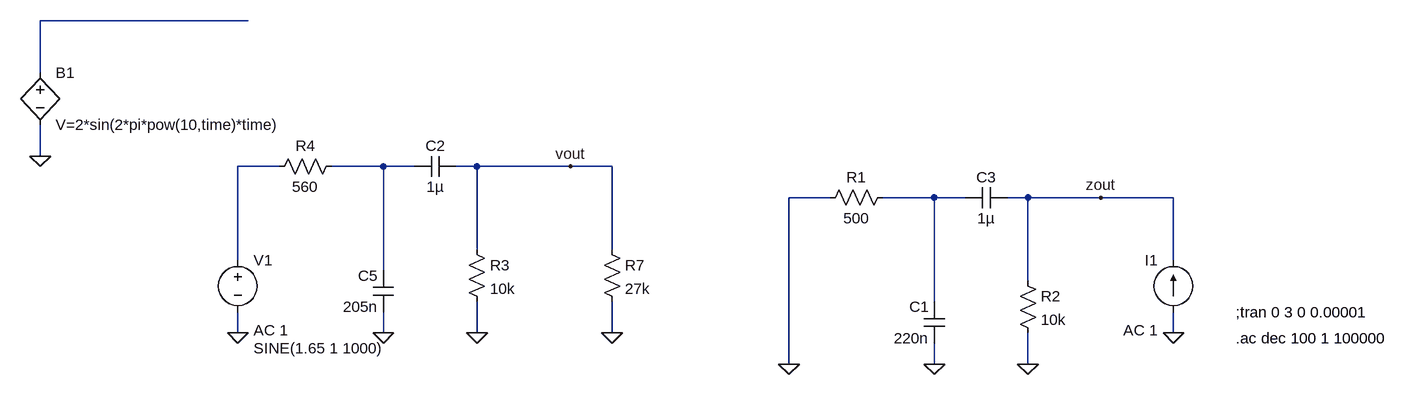
[diagram p0: schematic antialising_output.asc]
antialising_output.asc, the LTspice schematic file:
Version 4
SHEET 1 1128 680
WIRE -672 -64 -992 -64
WIRE -992 16 -992 -64
WIRE -992 144 -992 96
WIRE -624 160 -688 160
WIRE -464 160 -544 160
WIRE -416 160 -464 160
WIRE -320 160 -352 160
WIRE -176 160 -320 160
WIRE -112 160 -176 160
WIRE 224 208 160 208
WIRE 384 208 304 208
WIRE 432 208 384 208
WIRE 528 208 496 208
WIRE 640 208 528 208
WIRE 752 208 640 208
WIRE -320 288 -320 160
WIRE -112 288 -112 160
WIRE -688 304 -688 160
WIRE 752 304 752 208
WIRE -464 320 -464 160
WIRE 528 336 528 208
WIRE 384 368 384 208
WIRE -688 416 -688 384
WIRE -464 416 -464 384
WIRE -320 416 -320 368
WIRE -112 416 -112 368
WIRE 752 416 752 384
WIRE 160 464 160 208
WIRE 384 464 384 432
WIRE 528 464 528 416
FLAG 752 416 0
FLAG -688 416 0
FLAG -176 160 vout
FLAG -320 416 0
FLAG -992 144 0
FLAG -112 416 0
FLAG -464 416 0
FLAG 160 464 0
FLAG 528 464 0
FLAG 384 464 0
FLAG 640 208 zout
SYMBOL current 752 384 R180
WINDOW 0 24 80 Left 2
WINDOW 3 24 0 Left 2
WINDOW 123 24 -28 Left 2
WINDOW 39 0 0 Left 0
SYMATTR InstName I1
SYMATTR Value ""
SYMATTR Value2 AC 1
SYMBOL voltage -688 288 R0
WINDOW 3 24 152 Left 2
WINDOW 123 24 124 Left 2
WINDOW 39 0 0 Left 0
SYMATTR Value SINE(1.65 1 1000)
SYMATTR Value2 AC 1
SYMATTR InstName V1
SYMBOL bv -992 0 R0
SYMATTR InstName B1
SYMATTR Value V=2*sin(2*pi*pow(10,time)*time)
SYMBOL res -128 272 R0
SYMATTR InstName R7
SYMATTR Value 27k
SYMBOL res -528 144 R90
WINDOW 0 0 56 VBottom 2
WINDOW 3 32 56 VTop 2
SYMATTR InstName R4
SYMATTR Value 560
SYMBOL cap -448 384 R180
WINDOW 0 24 56 Left 2
WINDOW 3 24 8 Left 2
SYMATTR InstName C5
SYMATTR Value 205n
SYMBOL res -336 272 R0
SYMATTR InstName R3
SYMATTR Value 10k
SYMBOL cap -352 144 R90
WINDOW 0 0 32 VBottom 2
WINDOW 3 32 32 VTop 2
SYMATTR InstName C2
SYMATTR Value 1µ
SYMBOL res 320 192 R90
WINDOW 0 0 56 VBottom 2
WINDOW 3 32 56 VTop 2
SYMATTR InstName R1
SYMATTR Value 500
SYMBOL cap 400 432 R180
WINDOW 0 24 56 Left 2
WINDOW 3 24 8 Left 2
SYMATTR InstName C1
SYMATTR Value 220n
SYMBOL res 512 320 R0
SYMATTR InstName R2
SYMATTR Value 10k
SYMBOL cap 496 192 R90
WINDOW 0 0 32 VBottom 2
WINDOW 3 32 32 VTop 2
SYMATTR InstName C3
SYMATTR Value 1µ
TEXT 848 424 Left 2 !.ac dec 100 1 100000
TEXT 848 384 Left 2 !;tran 0 3 0 0.00001

The netlist it stands for:
* antialising_output.asc
I1 0 zout AC 1
V1 N002 0 SINE(1.65 1 1000) AC 1
B1 N001 0 V=2*sin(2*pi*pow(10,time)*time)
R7 vout 0 27k
R4 N003 N002 560
C5 0 N003 205n
R3 vout 0 10k
C2 vout N003 1µ
R1 N004 0 500
C1 0 N004 220n
R2 zout 0 10k
C3 zout N004 1µ
.ac dec 100 1 100000
;tran 0 3 0 0.00001
.backanno
.end

* Results of the author's LTspice run, read from the files saved beside the schematic
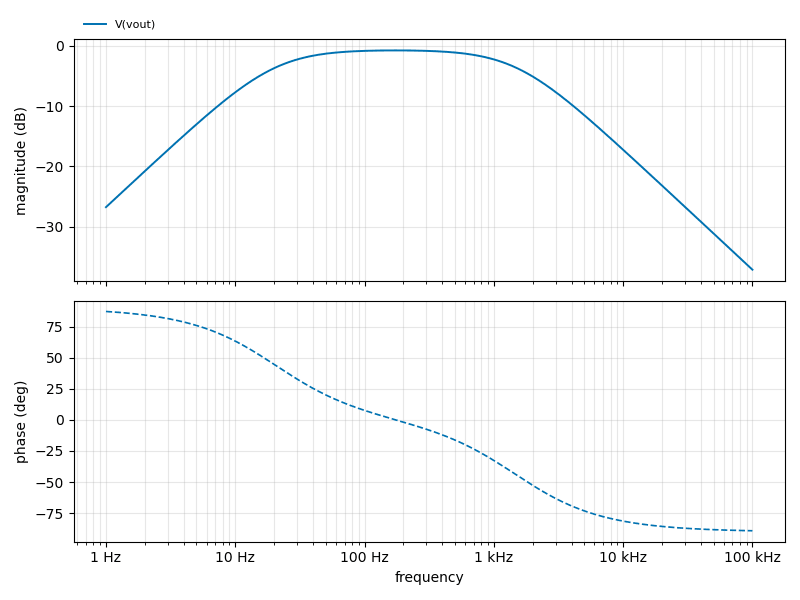
[diagram p1: AC Analysis of antialising_output.asc, plotted from the saved traces]
* AC Analysis, 1 run:
*   V(vout): -26.78 dB at 1 Hz, -37.16 dB at 100 kHz, peak -0.77 dB at 173.8 Hz, 3 dB below the peak at 19.71 Hz and 1.534 kHz